# Altium schematic sheet modFOC-GateDrivers.SchDoc: modFOC-GateDrivers
size A4; Author: Mathias Giller; CompanyName: HTL St. Pölten; Address1: modFOC; DocumentNumber: 5; Revision: 2.0; SheetNumber: 5; SheetTotal: 7
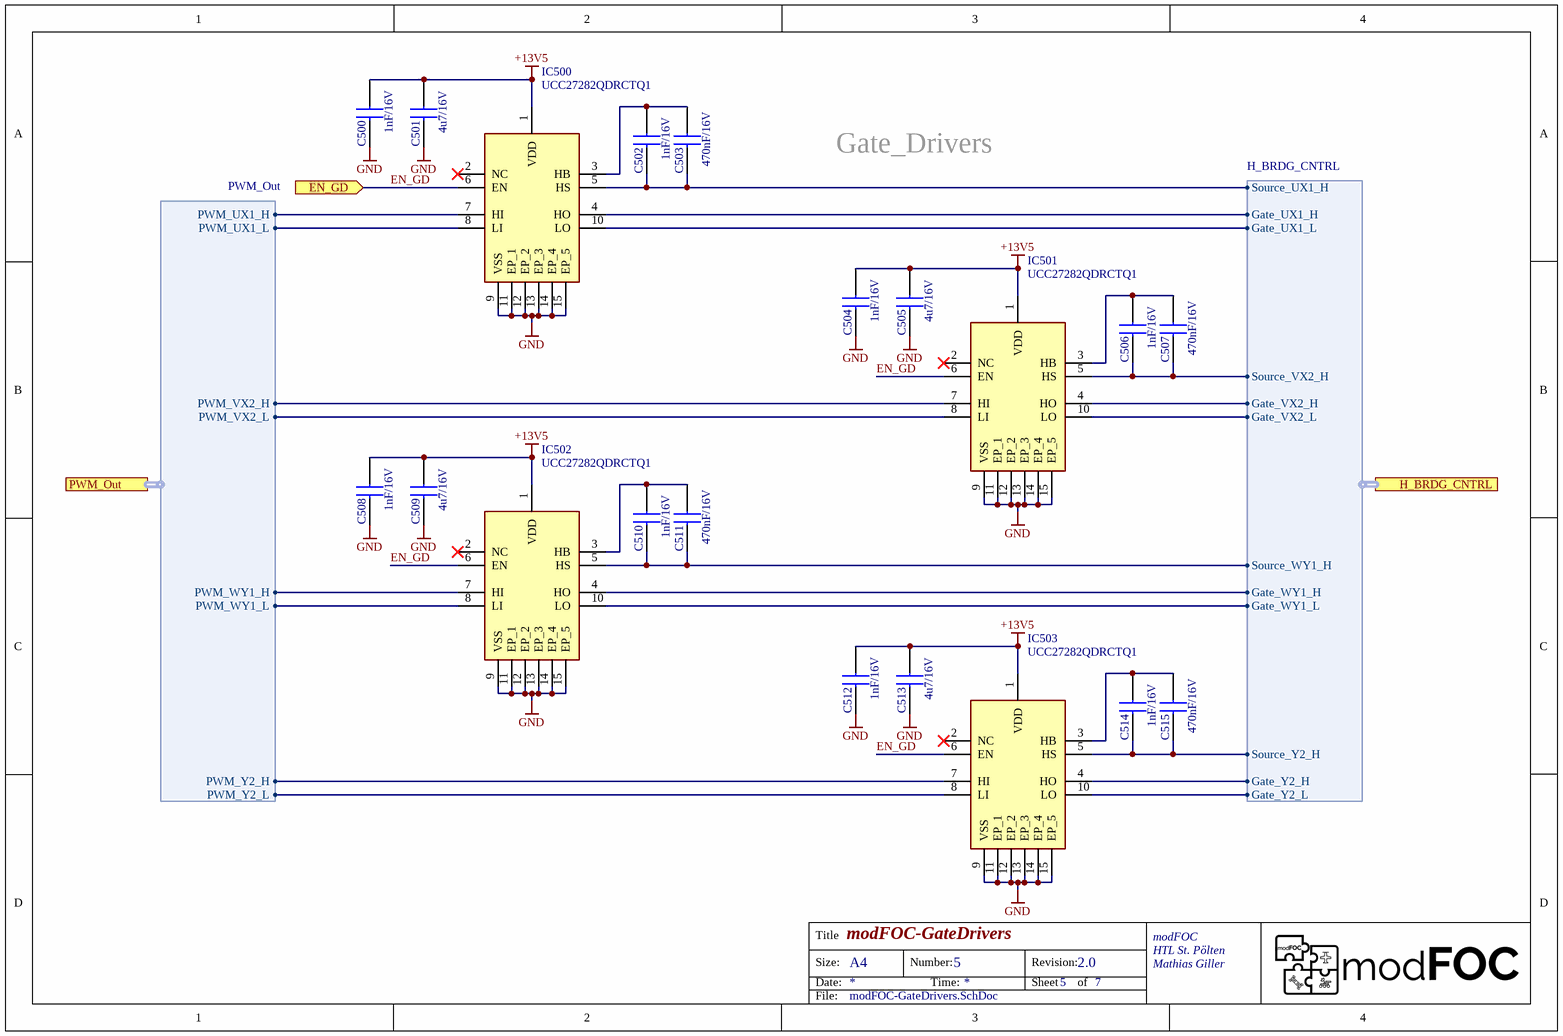
[diagram p0: modFOC-GateDrivers.SchDoc]

## Parts
C500  1nF/16V  [CAPC1608X97N]
C501  4u7/16V  [CAPC1608X97N]
C502  1nF/16V  [CAPC1608X97N]
C503  470nF/16V  [CAPC1608X97N]
C504  1nF/16V  [CAPC1608X97N]
C505  4u7/16V  [CAPC1608X97N]
C506  1nF/16V  [CAPC1608X97N]
C507  470nF/16V  [CAPC1608X97N]
C508  1nF/16V  [CAPC1608X97N]
C509  4u7/16V  [CAPC1608X97N]
C510  1nF/16V  [CAPC1608X97N]
C511  470nF/16V  [CAPC1608X97N]
C512  1nF/16V  [CAPC1608X97N]
C513  4u7/16V  [CAPC1608X97N]
C514  1nF/16V  [CAPC1608X97N]
C515  470nF/16V  [CAPC1608X97N]
IC500  UCC27282QDRCTQ1  [UCC27282DRCR]
IC501  UCC27282QDRCTQ1  [UCC27282DRCR]
IC502  UCC27282QDRCTQ1  [UCC27282DRCR]
IC503  UCC27282QDRCTQ1  [UCC27282DRCR]

## Ports
EN_GD (in), H_BRDG_CNTRL (harness H_BRDG_CNTRL), PWM_Out (harness PWM_Out)

## Harnesses
PWM_Out: PWM_UX1_H, PWM_UX1_L, PWM_VX2_H, PWM_VX2_L, PWM_WY1_H, PWM_WY1_L, PWM_Y2_L, PWM_Y2_H
H_BRDG_CNTRL: Gate_UX1_H, Source_UX1_H, Gate_UX1_L, Source_VX2_H, Gate_VX2_H, Gate_VX2_L, Source_WY1_H, Gate_WY1_H, Gate_WY1_L, Source_Y2_H, Gate_Y2_H, Gate_Y2_L

## Nets
+13V5: C500.2 C501.2 C504.2 C505.2 C508.2 C509.2 C512.2 C513.2 IC500.1(VDD) IC501.1(VDD) IC502.1(VDD) IC503.1(VDD)
GND: C500.1 C501.1 C504.1 C505.1 C508.1 C509.1 C512.1 C513.1 IC500.9(VSS) IC500.11(EP_1) IC500.12(EP_2) IC500.13(EP_3) IC500.14(EP_4) IC500.15(EP_5) IC501.9(VSS) IC501.11(EP_1) IC501.12(EP_2) IC501.13(EP_3) IC501.14(EP_4) IC501.15(EP_5) IC502.9(VSS) IC502.11(EP_1) IC502.12(EP_2) IC502.13(EP_3) IC502.14(EP_4) IC502.15(EP_5) IC503.9(VSS) IC503.11(EP_1) IC503.12(EP_2) IC503.13(EP_3) IC503.14(EP_4) IC503.15(EP_5)
EN_GD: IC500.6(EN) IC501.6(EN) IC502.6(EN) IC503.6(EN) ; port EN_GD
NetC502_1: C502.1 C503.1 IC500.5(HS) ; port H_BRDG_CNTRL.Source_UX1_H
NetC502_2: C502.2 C503.2 IC500.3(HB)
NetC506_1: C506.1 C507.1 IC501.5(HS) ; port H_BRDG_CNTRL.Source_VX2_H
NetC506_2: C506.2 C507.2 IC501.3(HB)
NetC510_1: C510.1 C511.1 IC502.5(HS) ; port H_BRDG_CNTRL.Source_WY1_H
NetC510_2: C510.2 C511.2 IC502.3(HB)
NetC514_1: C514.1 C515.1 IC503.5(HS) ; port H_BRDG_CNTRL.Source_Y2_H
NetC514_2: C514.2 C515.2 IC503.3(HB)
NetIC500_4: IC500.4(HO) ; port H_BRDG_CNTRL.Gate_UX1_H
NetIC500_7: IC500.7(HI) ; port PWM_Out.PWM_UX1_H
NetIC500_8: IC500.8(LI) ; port PWM_Out.PWM_UX1_L
NetIC500_10: IC500.10(LO) ; port H_BRDG_CNTRL.Gate_UX1_L
NetIC501_4: IC501.4(HO) ; port H_BRDG_CNTRL.Gate_VX2_H
NetIC501_7: IC501.7(HI) ; port PWM_Out.PWM_VX2_H
NetIC501_8: IC501.8(LI) ; port PWM_Out.PWM_VX2_L
NetIC501_10: IC501.10(LO) ; port H_BRDG_CNTRL.Gate_VX2_L
NetIC502_4: IC502.4(HO) ; port H_BRDG_CNTRL.Gate_WY1_H
NetIC502_7: IC502.7(HI) ; port PWM_Out.PWM_WY1_H
NetIC502_8: IC502.8(LI) ; port PWM_Out.PWM_WY1_L
NetIC502_10: IC502.10(LO) ; port H_BRDG_CNTRL.Gate_WY1_L
NetIC503_4: IC503.4(HO) ; port H_BRDG_CNTRL.Gate_Y2_H
NetIC503_7: IC503.7(HI) ; port PWM_Out.PWM_Y2_H
NetIC503_8: IC503.8(LI) ; port PWM_Out.PWM_Y2_L
NetIC503_10: IC503.10(LO) ; port H_BRDG_CNTRL.Gate_Y2_L

Not connected (* = marked no-connect by the designer): IC500 2(NC)*; IC501 2(NC)*; IC502 2(NC)*; IC503 2(NC)*

## Notes on the sheet
- Gate_Drivers
- Title
- Size:
- Date:
- A4
- Number:
- Time:
- Revision:
- Sheet
- of
- File:

## Library data of the parts
C500-C515 = C0603: Capacitor
IC500-IC503 = UCC27282QDRCTQ1: Halfbridge driver IC; Manufacturer_Name: Texas Instruments; Datasheet Link: https://www.ti.com/lit/ds/symlink/ucc27282.pdf?ts=1615361050656&ref_url=https%253A%252F%252Fwww.ti.com%252Fstore%252Fti%252Fen%252Fp%252Fproduct%252F%253Fp%253DUCC27282DRCR; Height: 1mm; Manufacturer_Part_Number: UCC27282QDRCTQ1; Mouser Part Number: 595-UCC27282DRCR; Mouser Price/Stock: https://www.mouser.co.uk/ProductDetail/Texas-Instruments/UCC27282DRCR?qs=PqoDHHvF64%252BEqc2WJXKXkQ%3D%3D; Arrow Part Number: UCC27282DRCR; Arrow Price/Stock: https://www.arrow.com/en/products/ucc27282drcr/texas-instruments?region=nac